# Altium schematic sheet Power.SchDoc
size A
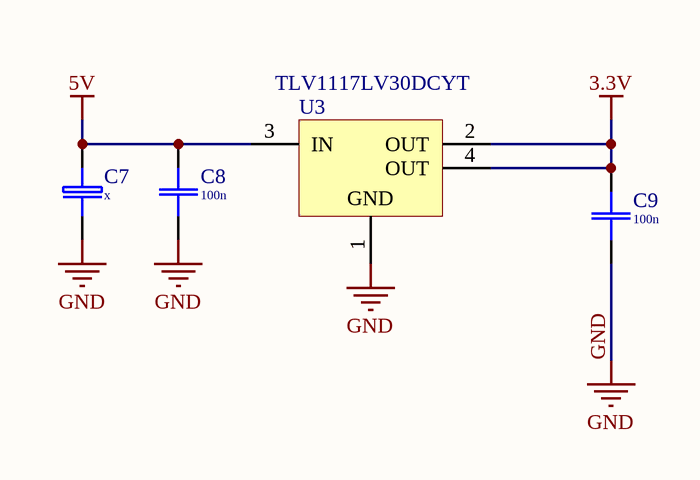
[diagram p0: Power.SchDoc]

## Parts
C7  x  [EL Case C (6032-28)]
C8  100n  [C0805(2013)]
C9  100n  [C0805(2013)]
U3  TLV1117LV30DCYT  [TI-DCY4_N]

## Nets
3.3V: C9.2 U3.2(OUT) U3.4(OUT)
5V: C7.1(+) C8.2 U3.3(IN)
GND: C7.2(-) C8.1 C9.1 U3.1(GND)

## Library data of the parts
C7 = EL Case C (6032-28): EL Tantalum Case C (6032-28); Price: 0.41; Value: x
C8 C9 = C-0805   50V 100n: SMD-0805 50V Y5V +80/-20%; Price: 0.05; Value: 100n
U3 = TLV1117LV30DCYT: Single Output LDO, 1 A, Fixed 3 V Output, 2 to 5.5 V Input, 4-pin SOT-223 (DCY), -40 to 125 degC, Green (RoHS & no Sb/Br); Manufacturer: Texas Instruments; Accuracy(%): 2; Fixed Output Options(V): 3; Iout(Max)(A): 1; Iq(Typ)(mA): 0.05; SubFamily: Single Channel LDO; Vdo(Typ)(mV): 1200; Vin(Max)(V): 5.5; DatasheetVersion: SBVS160A; PackageVersion: 4202506/B; PackageReference: DCY4; PackageDescription: 4-Pin Plastic Small Outline, Body 3.5 x 6.5 mm, Pitch 2.3 mm; Supplier 1: Digi-Key; Supplier Part Number 1: 296-34848-2-ND; Supplier 2: Farnell; Supplier Part Number 2: 2214986; Supplier 3: Newark; Supplier Part Number 3: 45W6437; Supplier 4: Newark; Supplier Part Number 4: 27W9631; Supplier 5: Mouser; Supplier Part Number 5: 595-TLV1117LV30DCYT; Eco-Plan: Green (RoHS & no Sb/Br); Vin(Min)(V): 2; Vout Adj(Max)(V): 3; Vout Adj(Min)(V): 3; Mounting Technology: Surface Mount; Code_JEDEC: TO-261; PartNumber: TLV1117LV30DCYT; ComponentLink1Description: Manufacturer URL; ComponentLink1URL: http://www.ti.com/; ComponentLink2Description: Datasheet; ComponentLink2URL: http://www.ti.com/general/docs/lit/getliterature.tsp?genericPartNumber=TLV1117LV30&fileType=pdf; ComponentLink3Description: Package Specification; ComponentLink3URL: http://www.ti.com/litv/pdf/mpds094a